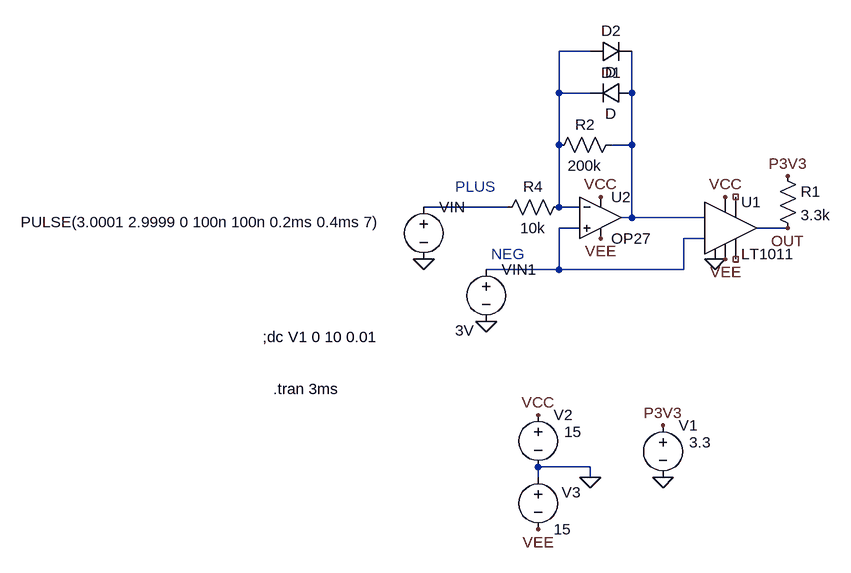
[diagram p0: schematic Draft43.asc]
Draft43.asc, the LTspice schematic file:
Version 4
SHEET 1 1440 868
WIRE -112 -64 -160 -64
WIRE -160 0 -160 -64
WIRE -112 0 -160 0
WIRE -48 0 -48 -64
WIRE -160 80 -160 0
WIRE -48 80 -48 0
WIRE -48 80 -80 80
WIRE -240 176 -368 176
WIRE -160 176 -160 80
WIRE -128 176 -160 176
WIRE -48 192 -48 80
WIRE -48 192 -64 192
WIRE 64 192 -48 192
WIRE -128 208 -160 208
WIRE 192 208 144 208
WIRE 64 224 32 224
WIRE -160 272 -160 208
WIRE -160 272 -272 272
WIRE 32 272 32 224
WIRE 32 272 -160 272
WIRE -112 576 -192 576
WIRE -192 592 -192 576
WIRE -112 592 -112 576
FLAG -368 256 0
FLAG -112 592 0
FLAG -192 496 VCC
FLAG -192 672 VEE
FLAG -96 160 VCC
FLAG -96 224 VEE
FLAG -272 352 0
FLAG 96 160 VCC
FLAG 96 256 VEE
FLAG 80 256 0
FLAG 0 512 P3V3
FLAG 0 592 0
FLAG 192 128 P3V3
FLAG 192 208 OUT
SYMBOL voltage -368 160 R0
WINDOW 123 0 0 Left 0
WINDOW 39 0 0 Left 0
WINDOW 3 -620 39 Left 2
SYMATTR Value PULSE(3.0001 2.9999 0 100n 100n 0.2ms 0.4ms 7)
SYMATTR InstName VIN
SYMBOL voltage -192 480 R0
WINDOW 123 0 0 Left 0
WINDOW 39 0 0 Left 0
WINDOW 3 40 42 Left 2
SYMATTR Value 15
SYMATTR InstName V2
SYMBOL voltage -192 576 R0
WINDOW 123 0 0 Left 0
WINDOW 39 0 0 Left 0
WINDOW 0 36 39 Left 2
SYMATTR InstName V3
SYMATTR Value 15
SYMBOL res -144 160 R90
WINDOW 0 0 56 VBottom 2
WINDOW 3 32 56 VTop 2
SYMATTR InstName R4
SYMATTR Value 10k
SYMBOL res -64 64 R90
WINDOW 0 0 56 VBottom 2
WINDOW 3 32 56 VTop 2
SYMATTR InstName R2
SYMATTR Value 200k
SYMBOL diode -48 -16 R90
WINDOW 0 0 32 VBottom 2
WINDOW 3 32 32 VTop 2
SYMATTR InstName D1
SYMBOL diode -112 -48 R270
WINDOW 0 32 32 VTop 2
WINDOW 3 0 32 VBottom 2
SYMATTR InstName D2
SYMBOL voltage -272 256 R0
WINDOW 123 0 0 Left 0
WINDOW 39 0 0 Left 0
WINDOW 3 -48 110 Left 2
SYMATTR Value 3V
SYMATTR InstName VIN1
SYMBOL res 176 112 R0
SYMATTR InstName R1
SYMATTR Value 3.3k
SYMBOL voltage 0 496 R0
WINDOW 123 0 0 Left 0
WINDOW 39 0 0 Left 0
WINDOW 3 40 42 Left 2
SYMATTR Value 3.3
SYMATTR InstName V1
SYMBOL OpAmps\\OP27 -96 128 R0
SYMATTR InstName U2
SYMBOL Comparators\\LT1011 96 208 R0
SYMATTR InstName U1
TEXT -616 376 Left 2 !;dc V1 0 10 0.01
TEXT -600 456 Left 2 !.tran 3ms
TEXT -320 144 Left 2 ;PLUS
TEXT -264 248 Left 2 ;NEG

The netlist it stands for:
* Draft43.asc
VIN N003 0 PULSE(3.0001 2.9999 0 100n 100n 0.2ms 0.4ms 7)
V2 VCC 0 15
V3 0 VEE 15
R4 N001 N003 10k
R2 N002 N001 200k
D1 N002 N001 D
D2 N001 N002 D
VIN1 N004 0 3V
R1 P3V3 OUT 3.3k
V1 P3V3 0 3.3
XU2 N004 N001 VCC VEE N002 OP27  ; pins In+ In- V+ V- OUT
XU1 0 N004 N002 VEE NC_01 NC_02 OUT VCC LT1011
.model D D
.lib standard.dio
;dc V1 0 10 0.01
.tran 3ms
* PLUS
* NEG
.lib ADI.lib
.lib LTC1.lib
.backanno
.end